# Altium project МПСУ.464421.22-01.PrjPcb (part 2 of 2)

## Sheet МПСУ.464421.22-01 Power.SchDoc
size 594 x 420 mm; Address1: Address1; Address2: Address2; Address3: Address3; Address4: Address4; SheetNumber: 6; SheetTotal: 6; OboznachenieSCH: МПСУ.464421.22-01; DocumentTypeSCH: Э3; DocumentName1SCH: Плата; NachOtdelaSCH: Орешкин; UtverjdenSCH: Утвержден
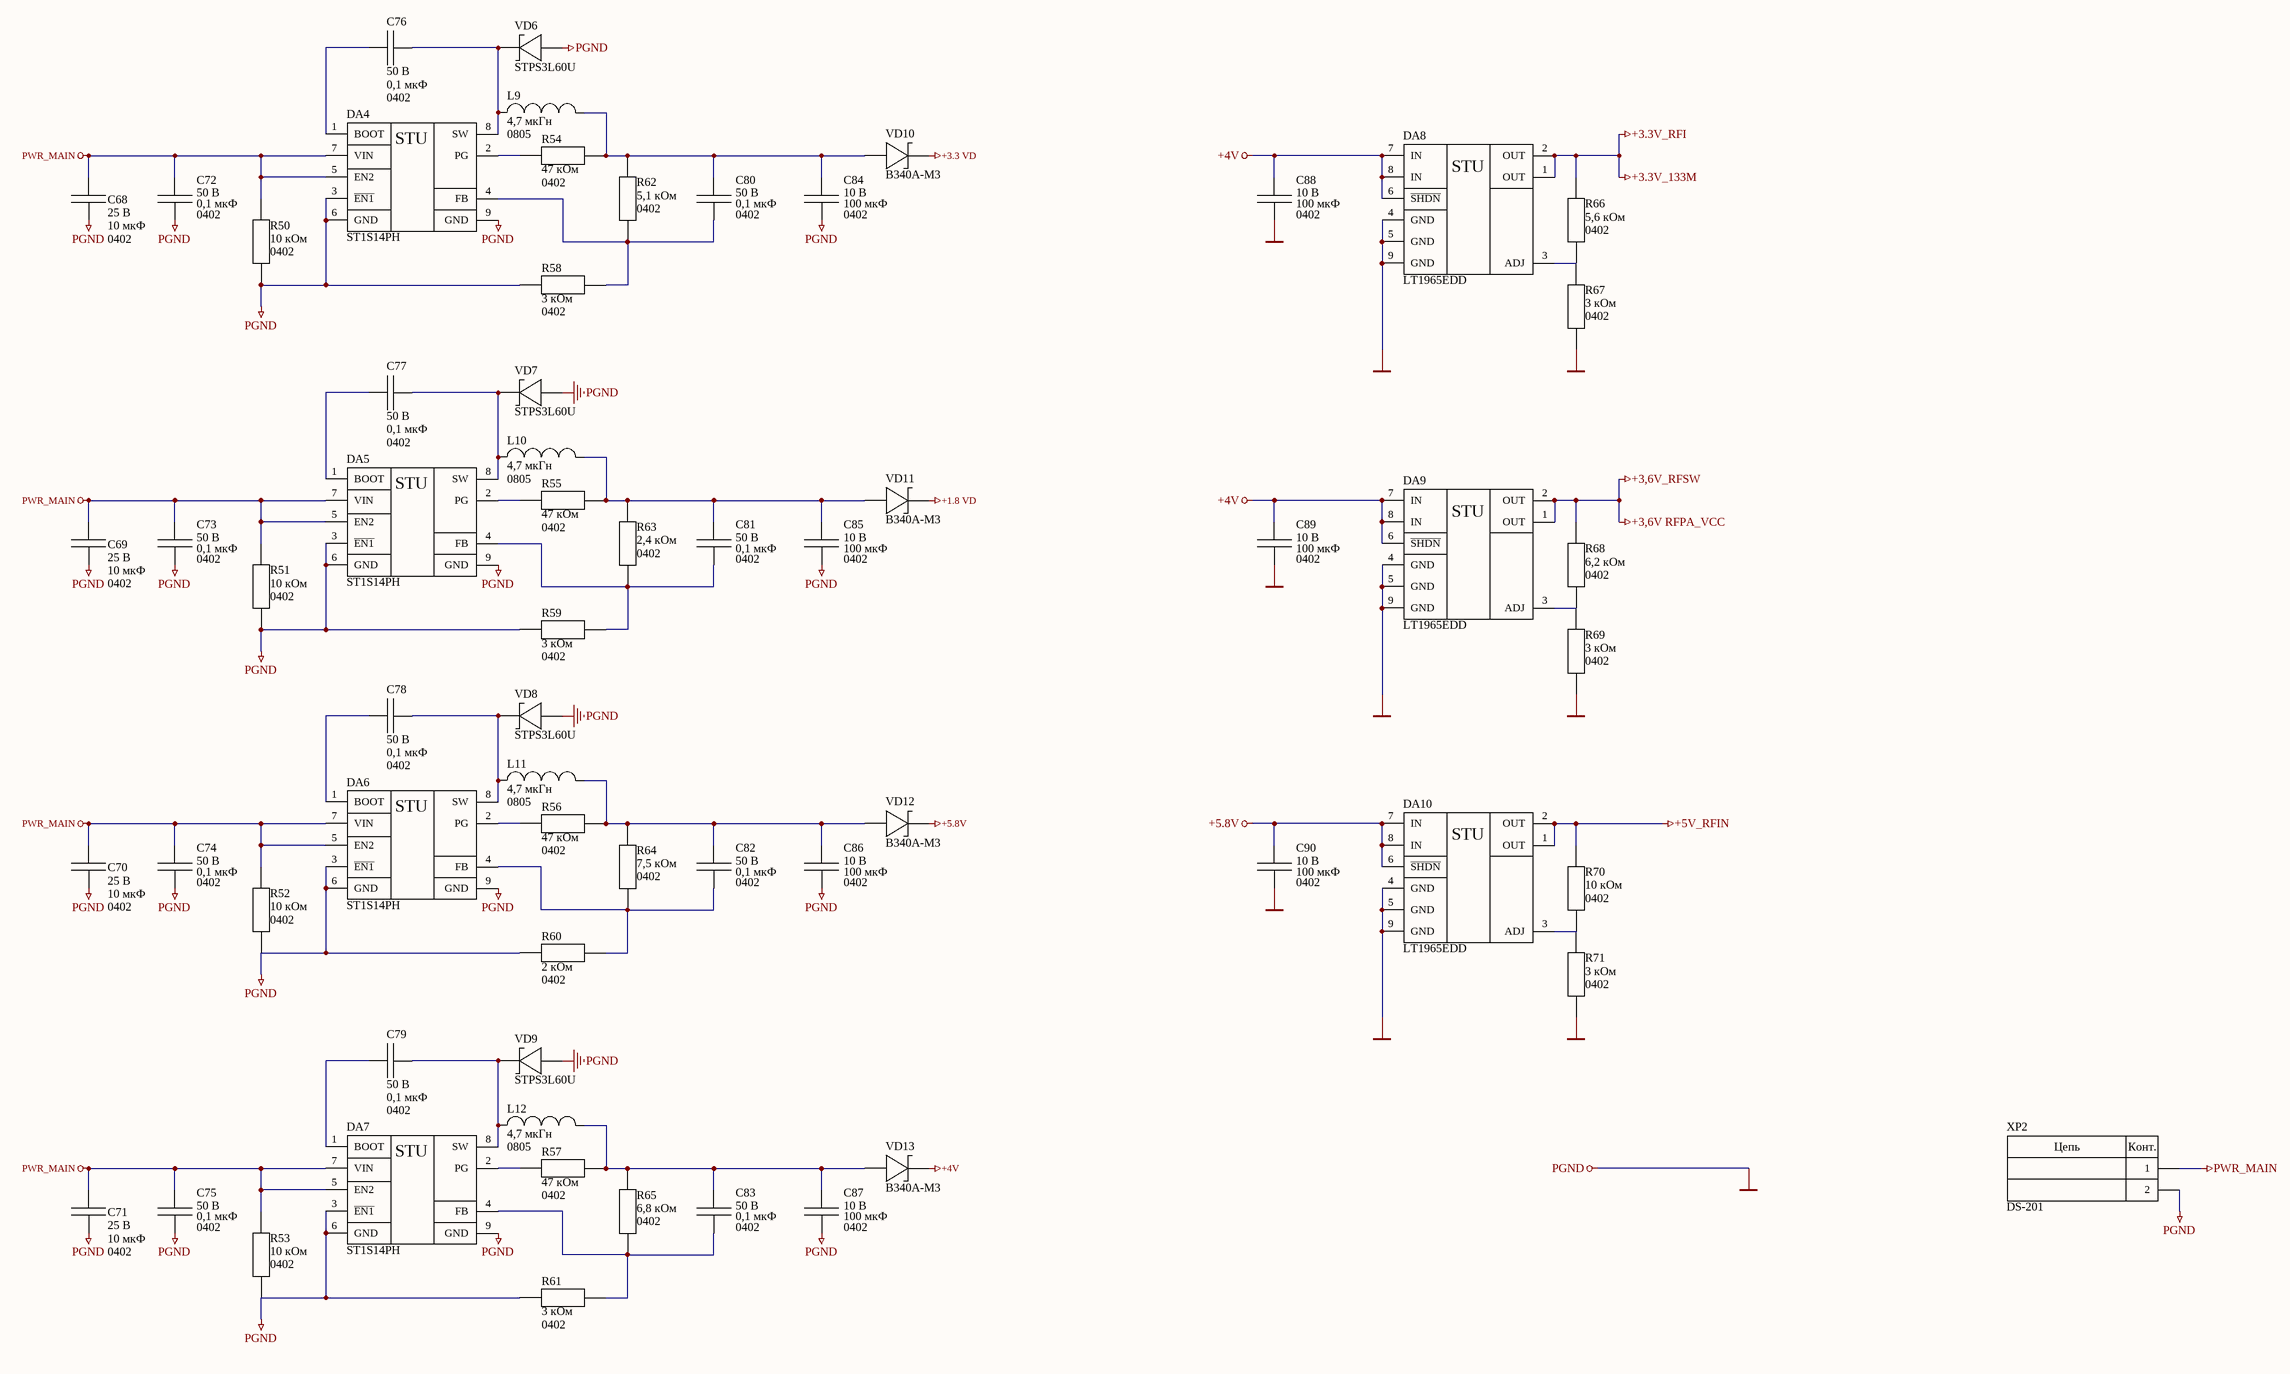
[diagram p5: МПСУ.464421.22-01 Power.SchDoc]

### Parts
C68  value 10 мкФ  Peak_Condition: 25 В  Package: 0402  [CAPC100X50X55L20N]  (hidden comment: 10 мкФ ± 10 % 25 В X5R 0402 GRM188R61E106KA73J)
C69  value 10 мкФ  Peak_Condition: 25 В  Package: 0402  [CAPC100X50X55L20N]  (hidden comment: 10 мкФ ± 10 % 25 В X5R 0402 GRM188R61E106KA73J)
C70  value 10 мкФ  Peak_Condition: 25 В  Package: 0402  [CAPC100X50X55L20N]  (hidden comment: 10 мкФ ± 10 % 25 В X5R 0402 GRM188R61E106KA73J)
C71  value 10 мкФ  Peak_Condition: 25 В  Package: 0402  [CAPC100X50X55L20N]  (hidden comment: 10 мкФ ± 10 % 25 В X5R 0402 GRM188R61E106KA73J)
C72  value 0,1 мкФ  Peak_Condition: 50 В  Package: 0402  [CAPC100X50X55L20N]  (hidden comment: 0,1 мкФ ± 10 % 50 В X7R 0402 GRM155R71H104KE14J)
C73  value 0,1 мкФ  Peak_Condition: 50 В  Package: 0402  [CAPC100X50X55L20N]  (hidden comment: 0,1 мкФ ± 10 % 50 В X7R 0402 GRM155R71H104KE14J)
C74  value 0,1 мкФ  Peak_Condition: 50 В  Package: 0402  [CAPC100X50X55L20N]  (hidden comment: 0,1 мкФ ± 10 % 50 В X7R 0402 GRM155R71H104KE14J)
C75  value 0,1 мкФ  Peak_Condition: 50 В  Package: 0402  [CAPC100X50X55L20N]  (hidden comment: 0,1 мкФ ± 10 % 50 В X7R 0402 GRM155R71H104KE14J)
C76  value 0,1 мкФ  Peak_Condition: 50 В  Package: 0402  [CAPC100X50X55L20N]  (hidden comment: 0,1 мкФ ± 10 % 50 В X7R 0402 GRM155R71H104KE14J)
C77  value 0,1 мкФ  Peak_Condition: 50 В  Package: 0402  [CAPC100X50X55L20N]  (hidden comment: 0,1 мкФ ± 10 % 50 В X7R 0402 GRM155R71H104KE14J)
C78  value 0,1 мкФ  Peak_Condition: 50 В  Package: 0402  [CAPC100X50X55L20N]  (hidden comment: 0,1 мкФ ± 10 % 50 В X7R 0402 GRM155R71H104KE14J)
C79  value 0,1 мкФ  Peak_Condition: 50 В  Package: 0402  [CAPC100X50X55L20N]  (hidden comment: 0,1 мкФ ± 10 % 50 В X7R 0402 GRM155R71H104KE14J)
C80  value 0,1 мкФ  Peak_Condition: 50 В  Package: 0402  [CAPC100X50X55L20N]  (hidden comment: 0,1 мкФ ± 10 % 50 В X7R 0402 GRM155R71H104KE14J)
C81  value 0,1 мкФ  Peak_Condition: 50 В  Package: 0402  [CAPC100X50X55L20N]  (hidden comment: 0,1 мкФ ± 10 % 50 В X7R 0402 GRM155R71H104KE14J)
C82  value 0,1 мкФ  Peak_Condition: 50 В  Package: 0402  [CAPC100X50X55L20N]  (hidden comment: 0,1 мкФ ± 10 % 50 В X7R 0402 GRM155R71H104KE14J)
C83  value 0,1 мкФ  Peak_Condition: 50 В  Package: 0402  [CAPC100X50X55L20N]  (hidden comment: 0,1 мкФ ± 10 % 50 В X7R 0402 GRM155R71H104KE14J)
C84  value 100 мкФ  Peak_Condition: 10 В  Package: 0402  [CAPC100X50X55L20N]  (hidden comment: 100 мкФ ± 20 % 10 В JB 0402 C3216JB1A107M160AC)
C85  value 100 мкФ  Peak_Condition: 10 В  Package: 0402  [CAPC100X50X55L20N]  (hidden comment: 100 мкФ ± 20 % 10 В JB 0402 C3216JB1A107M160AC)
C86  value 100 мкФ  Peak_Condition: 10 В  Package: 0402  [CAPC100X50X55L20N]  (hidden comment: 100 мкФ ± 20 % 10 В JB 0402 C3216JB1A107M160AC)
C87  value 100 мкФ  Peak_Condition: 10 В  Package: 0402  [CAPC100X50X55L20N]  (hidden comment: 100 мкФ ± 20 % 10 В JB 0402 C3216JB1A107M160AC)
C88  value 100 мкФ  Peak_Condition: 10 В  Package: 0402  [CAPC100X50X55L20N]  (hidden comment: 100 мкФ ± 20 % 10 В JB 0402 C3216JB1A107M160AC)
C89  value 100 мкФ  Peak_Condition: 10 В  Package: 0402  [CAPC100X50X55L20N]  (hidden comment: 100 мкФ ± 20 % 10 В JB 0402 C3216JB1A107M160AC)
C90  value 100 мкФ  Peak_Condition: 10 В  Package: 0402  [CAPC100X50X55L20N]  (hidden comment: 100 мкФ ± 20 % 10 В JB 0402 C3216JB1A107M160AC)
DA4  ST1S14PH  [SOP127P600X175_HS-9N]
DA5  ST1S14PH  [SOP127P600X175_HS-9N]
DA6  ST1S14PH  [SOP127P600X175_HS-9N]
DA7  ST1S14PH  [SOP127P600X175_HS-9N]
DA8  LT1965EDD  [SON9P50_300X300X80L40X25T244X160N]
DA9  LT1965EDD  [SON9P50_300X300X80L40X25T244X160N]
DA10  LT1965EDD  [SON9P50_300X300X80L40X25T244X160N]
L9  value 4,7 мкГн  Package: 0805  [INDC200X120X110L50N]  (hidden comment: 4,7 мкГн ± 30 % 800 мА 0805 LQM21PZ4R7NGRD)
L10  value 4,7 мкГн  Package: 0805  [INDC200X120X110L50N]  (hidden comment: 4,7 мкГн ± 30 % 800 мА 0805 LQM21PZ4R7NGRD)
L11  value 4,7 мкГн  Package: 0805  [INDC200X120X110L50N]  (hidden comment: 4,7 мкГн ± 30 % 800 мА 0805 LQM21PZ4R7NGRD)
L12  value 4,7 мкГн  Package: 0805  [INDC200X120X110L50N]  (hidden comment: 4,7 мкГн ± 30 % 800 мА 0805 LQM21PZ4R7NGRD)
R50  value 10 кОм  Package: 0402  [RESC100X50X40L25N]  (hidden comment: 10 кОм ± 5 % 0 Вт 0402 RI0402L103JT)
R51  value 10 кОм  Package: 0402  [RESC100X50X40L25N]  (hidden comment: 10 кОм ± 5 % 0 Вт 0402 RI0402L103JT)
R52  value 10 кОм  Package: 0402  [RESC100X50X40L25N]  (hidden comment: 10 кОм ± 5 % 0 Вт 0402 RI0402L103JT)
R53  value 10 кОм  Package: 0402  [RESC100X50X40L25N]  (hidden comment: 10 кОм ± 5 % 0 Вт 0402 RI0402L103JT)
R54  value 47 кОм  Package: 0402  [RESC100X50X40L25N]  (hidden comment: 47 кОм ± 5 % 0 Вт 0402 RI0402L473JT)
R55  value 47 кОм  Package: 0402  [RESC100X50X40L25N]  (hidden comment: 47 кОм ± 5 % 0 Вт 0402 RI0402L473JT)
R56  value 47 кОм  Package: 0402  [RESC100X50X40L25N]  (hidden comment: 47 кОм ± 5 % 0 Вт 0402 RI0402L473JT)
R57  value 47 кОм  Package: 0402  [RESC100X50X40L25N]  (hidden comment: 47 кОм ± 5 % 0 Вт 0402 RI0402L473JT)
R58  value 3 кОм  Package: 0402  [RESC100X50X40L25N]  (hidden comment: 3 кОм ± 1 % 0 Вт 0402 RC0402FR-073KL)
R59  value 3 кОм  Package: 0402  [RESC100X50X40L25N]  (hidden comment: 3 кОм ± 1 % 0 Вт 0402 RC0402FR-073KL)
R60  value 2 кОм  Package: 0402  [RESC100X50X40L25N]  (hidden comment: 2 кОм ± 5 % 0 Вт 0402 RC-02W202JT)
R61  value 3 кОм  Package: 0402  [RESC100X50X40L25N]  (hidden comment: 3 кОм ± 1 % 0 Вт 0402 RC0402FR-073KL)
R62  value 5,1 кОм  Package: 0402  [RESC100X50X40L25N]  (hidden comment: 5,1 кОм ± 1 % 0 Вт 0402 RI0402L5101FT)
R63  value 2,4 кОм  Package: 0402  [RESC100X50X40L25N]  (hidden comment: 2,4 кОм ± 1 % 0 Вт 0402 RC0402FR-072K4L)
R64  value 7,5 кОм  Package: 0402  [RESC100X50X40L25N]  (hidden comment: 7,5 кОм ± 1 % 0 Вт 0402 RI0402L7501FT)
R65  value 6,8 кОм  Package: 0402  [RESC100X50X40L25N]  (hidden comment: 6,8 кОм ± 5 % 0 Вт 0402 RC-02W682JT)
R66  value 5,6 кОм  Package: 0402  [RESC100X50X40L25N]  (hidden comment: 5,6 кОм ± 1 % 0 Вт 0402 RI0402L5601FT)
R67  value 3 кОм  Package: 0402  [RESC100X50X40L25N]  (hidden comment: 3 кОм ± 1 % 0 Вт 0402 RC0402FR-073KL)
R68  value 6,2 кОм  Package: 0402  [RESC100X50X40L25N]  (hidden comment: 6,2 кОм ± 5 % 0 Вт 0402 RI0402L622JT)
R69  value 3 кОм  Package: 0402  [RESC100X50X40L25N]  (hidden comment: 3 кОм ± 1 % 0 Вт 0402 RC0402FR-073KL)
R70  value 10 кОм  Package: 0402  [RESC100X50X40L25N]  (hidden comment: 10 кОм ± 5 % 0 Вт 0402 RI0402L103JT)
R71  value 3 кОм  Package: 0402  [RESC100X50X40L25N]  (hidden comment: 3 кОм ± 1 % 0 Вт 0402 RC0402FR-073KL)
VD6  STPS3L60U  [DIOM5436X11N]
VD7  STPS3L60U  [DIOM5436X11N]
VD8  STPS3L60U  [DIOM5436X11N]
VD9  STPS3L60U  [DIOM5436X11N]
VD10  B340A-M3  [DIOC4227X10N]
VD11  B340A-M3  [DIOC4227X10N]
VD12  B340A-M3  [DIOC4227X10N]
VD13  B340A-M3  [DIOC4227X10N]
XP2  DS-201  [DS-201]

### Nets
+1.8 VD: VD11.1(C)
+3,6V RFPA_VCC: DA9.1(OUT) DA9.2(OUT) R68.1  [also labelled +3,6V_RFSW]
+3.3 VD: VD10.1(C)
+3.3V_133M: DA8.1(OUT) DA8.2(OUT) R66.1  [also labelled +3.3V_RFI]
+4V: C88.1 C89.1 DA8.6(~{SHDN}) DA8.7(IN) DA8.8(IN) DA9.6(~{SHDN}) DA9.7(IN) DA9.8(IN) VD13.1(C)
+5.8V: C90.1 DA10.6(~{SHDN}) DA10.7(IN) DA10.8(IN) VD12.1(C)
+5V_RFIN: DA10.1(OUT) DA10.2(OUT) R70.1
GND: C68.2 C69.2 C70.2 C71.2 C72.2 C73.2 C74.2 C75.2 C84.2 C85.2 C86.2 C87.2 C88.2 C89.2 C90.2 DA4.3(~{EN1}) DA4.6(GND) DA4.9(GND) DA5.3(~{EN1}) DA5.6(GND) DA5.9(GND) DA6.3(~{EN1}) DA6.6(GND) DA6.9(GND) DA7.3(~{EN1}) DA7.6(GND) DA7.9(GND) DA8.4(GND) DA8.5(GND) DA8.9(GND) DA9.4(GND) DA9.5(GND) DA9.9(GND) DA10.4(GND) DA10.5(GND) DA10.9(GND) R50.2 R51.2 R52.2 R53.2 R58.2 R59.2 R60.2 R61.2 R67.2 R69.2 R71.2 VD6.2(A) VD7.2(A) VD8.2(A) VD9.2(A) XP2.2  [also labelled PGND]
PWR_MAIN: C68.1 C69.1 C70.1 C71.1 C72.1 C73.1 C74.1 C75.1 DA4.5(EN2) DA4.7(VIN) DA5.5(EN2) DA5.7(VIN) DA6.5(EN2) DA6.7(VIN) DA7.5(EN2) DA7.7(VIN) R50.1 R51.1 R52.1 R53.1 XP2.1
NetC76_1: C76.1 DA4.1(BOOT)
NetC76_2: C76.2 DA4.8(SW) L9.1 VD6.1(C)
NetC77_1: C77.1 DA5.1(BOOT)
NetC77_2: C77.2 DA5.8(SW) L10.1 VD7.1(C)
NetC78_1: C78.1 DA6.1(BOOT)
NetC78_2: C78.2 DA6.8(SW) L11.1 VD8.1(C)
NetC79_1: C79.1 DA7.1(BOOT)
NetC79_2: C79.2 DA7.8(SW) L12.1 VD9.1(C)
NetC80_1: C80.1 C84.1 L9.2 R54.2 R62.1 VD10.2(A)
NetC80_2: C80.2 DA4.4(FB) R58.1 R62.2
NetC81_1: C81.1 C85.1 L10.2 R55.2 R63.1 VD11.2(A)
NetC81_2: C81.2 DA5.4(FB) R59.1 R63.2
NetC82_1: C82.1 C86.1 L11.2 R56.2 R64.1 VD12.2(A)
NetC82_2: C82.2 DA6.4(FB) R60.1 R64.2
NetC83_1: C83.1 C87.1 L12.2 R57.2 R65.1 VD13.2(A)
NetC83_2: C83.2 DA7.4(FB) R61.1 R65.2
NetDA4_2: DA4.2(PG) R54.1
NetDA5_2: DA5.2(PG) R55.1
NetDA6_2: DA6.2(PG) R56.1
NetDA7_2: DA7.2(PG) R57.1
NetDA8_3: DA8.3(ADJ) R66.2 R67.1
NetDA9_3: DA9.3(ADJ) R68.2 R69.1
NetDA10_3: DA10.3(ADJ) R70.2 R71.1

### Notes on the sheet
- Подп. и дата
- Инв. № дубл.
- Взам. инв. №
- Инв. № подл.
- Изм.
- Лист
- № докум.
- Подп.
- Дата
- Копировал
- Формат А2
- (in symbol DS-201) Цепь; Конт.
- (in symbol LT1965*DD) STU
- (in symbol ST1S14PH) STU

### Library data of the parts
C68-C83 = C 0402: Capacitor 0402; Manufacturer: Murata; Tolerance: 10 %; Designer: Свидерский; 3D_Body: +; Category: Passive; Subcategory: Capacitor; Status: Approved
  C68-C71: PartNumber: GRM188R61E106KA73J; Dielectric: X5R
  C72-C83: PartNumber: GRM155R71H104KE14J; Dielectric: X7R
C84-C90 = C 0402: Capacitor 0402; Manufacturer: TDK; Tolerance: 20 %; Designer: Свидерский; 3D_Body: +; PartNumber: C3216JB1A107M160AC; Category: Passive; Subcategory: Capacitor; Dielectric: JB; Status: Approved
DA4-DA7 = ST1S14PH: Up to 3 A step-down switching regulator; Manufacturer: STMicroelectronics; 3D_Body: +; Designer: Затонская; ComponentLink1Description: Техническое описание; ComponentLink1URL: Q:\Libs\Descriptions_PDF\ST1S14.pdf; Category: IC; Package: HSOP-8; Status: Check; Subcategory: Power Supply; PartNumber: ST1S14PH
DA8-DA10 = LT1965*DD: 1.1A, Low Noise,  Low Dropout Linear Regulator; Manufacturer: Analog Devices; Designer: Свидерский; 3D_Body: +; ComponentLink1URL: Q:\Libs\Descriptions_PDF\LT1965.pdf; ComponentLink1Description: Техническое описание; Subcategory: Power Supply; Category: IC; Package: 8-LEAD (3mm × 3mm) PLASTIC DFN; Status: Approved; PartNumber: LT1965EDD
L9-L12 = L 0805: Inductor 0805; Manufacturer: Murata; Designer: Свидерский; Tolerance: 30 %; Peak_Condition: 800 мА; 3D_Body: +; PartNumber: LQM21PZ4R7NGRD; Category: Passive; Subcategory: Inductor; Status: Approved
R50-R57 R68 R70 = R 0402: Resistor 0402; Manufacturer: Hottech; Designer: Свидерский; 3D_Body: +; Tolerance: 5 %; Peak_Condition: 0 Вт; Category: Passive; Subcategory: Resistor; Status: Approved
  R50-R53 R70: PartNumber: RI0402L103JT
  R54-R57: PartNumber: RI0402L473JT
  R68: PartNumber: RI0402L622JT
R58 R59 R61 R63 R67 R69 R71 = R 0402: Resistor 0402; Manufacturer: Thunder; Designer: Свидерский; 3D_Body: +; Tolerance: 1 %; Peak_Condition: 0 Вт; Category: Passive; Subcategory: Resistor; Status: Approved
  R58 R59 R61 R67 R69 R71: PartNumber: RC0402FR-073KL
  R63: PartNumber: RC0402FR-072K4L
R60 R65 = R 0402: Resistor 0402; Manufacturer: Fenghua; Designer: Свидерский; 3D_Body: +; Tolerance: 5 %; Peak_Condition: 0 Вт; Category: Passive; Subcategory: Resistor; Status: Approved
  R60: PartNumber: RC-02W202JT
  R65: PartNumber: RC-02W682JT
R62 R64 R66 = R 0402: Resistor 0402; Manufacturer: Hottech; Designer: Свидерский; 3D_Body: +; Tolerance: 1 %; Peak_Condition: 0 Вт; Category: Passive; Subcategory: Resistor; Status: Approved
  R62: PartNumber: RI0402L5101FT
  R64: PartNumber: RI0402L7501FT
  R66: PartNumber: RI0402L5601FT
VD6-VD9 = STPS3L60: 60 V, 3 A low drop Schottky rectifier; Manufacturer: Diodes Incorporated; 3D_Body: +; Designer: Затонская; Category: Discrete; ComponentLink1Description: Техническое описание; ComponentLink1URL: Q:\Libs\Descriptions_PDF\STPS3L60.pdf; Package: SMB; Status: Check; Subcategory: Diode; PartNumber: STPS3L60U
VD10-VD13 = B340A-M3: SURFACE MOUNT SCHOTTKY BARRIER RECTIFIER; Manufacturer: Diodes Incorporated; 3D_Body: +; Designer: Затонская; Category: Discrete; ComponentLink1Description: Техническое описание; ComponentLink1URL: Q:\Libs\Descriptions_PDF\DOC001652710.pdf; Package: SOD-123; Status: Check; Subcategory: Diode; PartNumber: B340A-M3
XP2 = DS-201: DC supply 2 PIN DC-005 2.1x5.5mm; Manufacturer: AMASS; 3D_Body: +; Designer: Лазба; System: Connector; ComponentLink1Description: Техническое описание; ComponentLink1URL: Q:\Libs\Descriptions_PDF\XT60PW.pdf; Category: Connector; Subcategory: Male; Pins: 2; Status: Check; PartNumber: DS-201

## Nets that join several sheets
+1.8 VD: МПСУ.464421.22-01 BBP (11 pins), МПСУ.464421.22-01 Power (VD11.1)
+3,6V RFPA_VCC: МПСУ.464421.22-01 RF_OUT (5 pins), МПСУ.464421.22-01 Switch,GPS, IO Connectors (C62.2 C63.2 DA3.9), МПСУ.464421.22-01 Power (DA9.1 DA9.2 R68.1)
+3.3 VD: МПСУ.464421.22-01 BBP (5 pins), МПСУ.464421.22-01 Switch,GPS, IO Connectors (C64.1 U3.6 U3.7 U3.8), МПСУ.464421.22-01 Power (VD10.1)
+3.3V_133M: МПСУ.464421.22-01 BBP (L5.1), МПСУ.464421.22-01 RF Interface (13 pins), МПСУ.464421.22-01 Power (DA8.1 DA8.2 R66.1)
+5V_RFIN: МПСУ.464421.22-01 RF_IN (C51.1 C53.1 C55.1 L6.1), МПСУ.464421.22-01 Power (DA10.1 DA10.2 R70.1)
GND: МПСУ.464421.22-01 BBP (38 pins), МПСУ.464421.22-01 RF Interface (36 pins), МПСУ.464421.22-01 RF_OUT (35 pins), МПСУ.464421.22-01 RF_IN (18 pins), МПСУ.464421.22-01 Switch,GPS, IO Connectors (21 pins), МПСУ.464421.22-01 Power (52 pins)
CLKO_A: МПСУ.464421.22-01 BBP (R40.2), МПСУ.464421.22-01 RF Interface (U1.10)
CLKO_B: МПСУ.464421.22-01 BBP (R41.2), МПСУ.464421.22-01 RF Interface (U2.10)
GPS_NSS: МПСУ.464421.22-01 BBP (DD1.9 R24.2), МПСУ.464421.22-01 Switch,GPS, IO Connectors (U3.4 XP1.10)
IRXD_A: МПСУ.464421.22-01 BBP (R38.2), МПСУ.464421.22-01 RF Interface (U1.15)
IRXD_B: МПСУ.464421.22-01 BBP (R34.1), МПСУ.464421.22-01 RF Interface (U2.15)
ITXD_A: МПСУ.464421.22-01 BBP (DD1.46), МПСУ.464421.22-01 RF Interface (R6.1)
ITXD_B: МПСУ.464421.22-01 BBP (DD1.37), МПСУ.464421.22-01 RF Interface (R10.1)
LNA_A_CTRL: МПСУ.464421.22-01 BBP (DD1.14), МПСУ.464421.22-01 Switch,GPS, IO Connectors (R46.1)
MISO_A: МПСУ.464421.22-01 BBP (R37.2), МПСУ.464421.22-01 RF Interface (U1.18)
MISO_B: МПСУ.464421.22-01 BBP (R33.1), МПСУ.464421.22-01 RF Interface (U2.18)
MOSI_A: МПСУ.464421.22-01 BBP (DD1.63), МПСУ.464421.22-01 RF Interface (R5.1)
MOSI_B: МПСУ.464421.22-01 BBP (DD1.20), МПСУ.464421.22-01 RF Interface (R9.1)
NSS_A: МПСУ.464421.22-01 BBP (DD1.64), МПСУ.464421.22-01 RF Interface (R12.1)
NSS_B: МПСУ.464421.22-01 BBP (DD1.19), МПСУ.464421.22-01 RF Interface (R11.1)
PA_A_CTRL: МПСУ.464421.22-01 BBP (DD1.15), МПСУ.464421.22-01 RF_OUT (R19.1)
PA_G0: МПСУ.464421.22-01 BBP (DD1.18), МПСУ.464421.22-01 RF_OUT (R17.1)
PA_G1: МПСУ.464421.22-01 BBP (DD1.17), МПСУ.464421.22-01 RF_OUT (R18.1)
QRXD_A: МПСУ.464421.22-01 BBP (R39.2), МПСУ.464421.22-01 RF Interface (U1.14)
QRXD_B: МПСУ.464421.22-01 BBP (R35.1), МПСУ.464421.22-01 RF Interface (U2.14)
QTXD_A: МПСУ.464421.22-01 BBP (DD1.47), МПСУ.464421.22-01 RF Interface (R13.1)
QTXD_B: МПСУ.464421.22-01 BBP (DD1.38), МПСУ.464421.22-01 RF Interface (R14.1)
RADIO_A_EN: МПСУ.464421.22-01 BBP (DD1.13), МПСУ.464421.22-01 Switch,GPS, IO Connectors (R47.1)
RADIO_RST: МПСУ.464421.22-01 BBP (DD1.25), МПСУ.464421.22-01 RF Interface (R2.1 R7.1)
RF_IN: МПСУ.464421.22-01 RF Interface (U1.27 U2.27), МПСУ.464421.22-01 RF_IN (L7.1 R42.1 R43.2)
RF_OUT: МПСУ.464421.22-01 RF Interface (T1.1), МПСУ.464421.22-01 RF_OUT (Z1.2)
RFSW_IN: МПСУ.464421.22-01 RF_IN (C57.2 C58.1), МПСУ.464421.22-01 Switch,GPS, IO Connectors (DA3.11)
RFSW_OUT: МПСУ.464421.22-01 RF_OUT (Z2.4), МПСУ.464421.22-01 Switch,GPS, IO Connectors (DA3.5)
SCK_A: МПСУ.464421.22-01 BBP (DD1.61), МПСУ.464421.22-01 RF Interface (R4.1)
SCK_B: МПСУ.464421.22-01 BBP (DD1.22), МПСУ.464421.22-01 RF Interface (R8.1)
SP_CLKO: МПСУ.464421.22-01 BBP (DD1.39), МПСУ.464421.22-01 RF Interface (R3.1)
SYS_CS: МПСУ.464421.22-01 BBP (DD1.5), МПСУ.464421.22-01 Switch,GPS, IO Connectors (XP1.9)
SYS_MISO: МПСУ.464421.22-01 BBP (DD1.3), МПСУ.464421.22-01 Switch,GPS, IO Connectors (XP1.5)
SYS_MOSI: МПСУ.464421.22-01 BBP (DD1.4), МПСУ.464421.22-01 Switch,GPS, IO Connectors (XP1.7)
SYS_RST: МПСУ.464421.22-01 BBP (DD1.1), МПСУ.464421.22-01 Switch,GPS, IO Connectors (XP1.4)
SYS_SCK: МПСУ.464421.22-01 BBP (DD1.2), МПСУ.464421.22-01 Switch,GPS, IO Connectors (XP1.3)